# Altium schematic sheet Sheet1.SchDoc
size A4
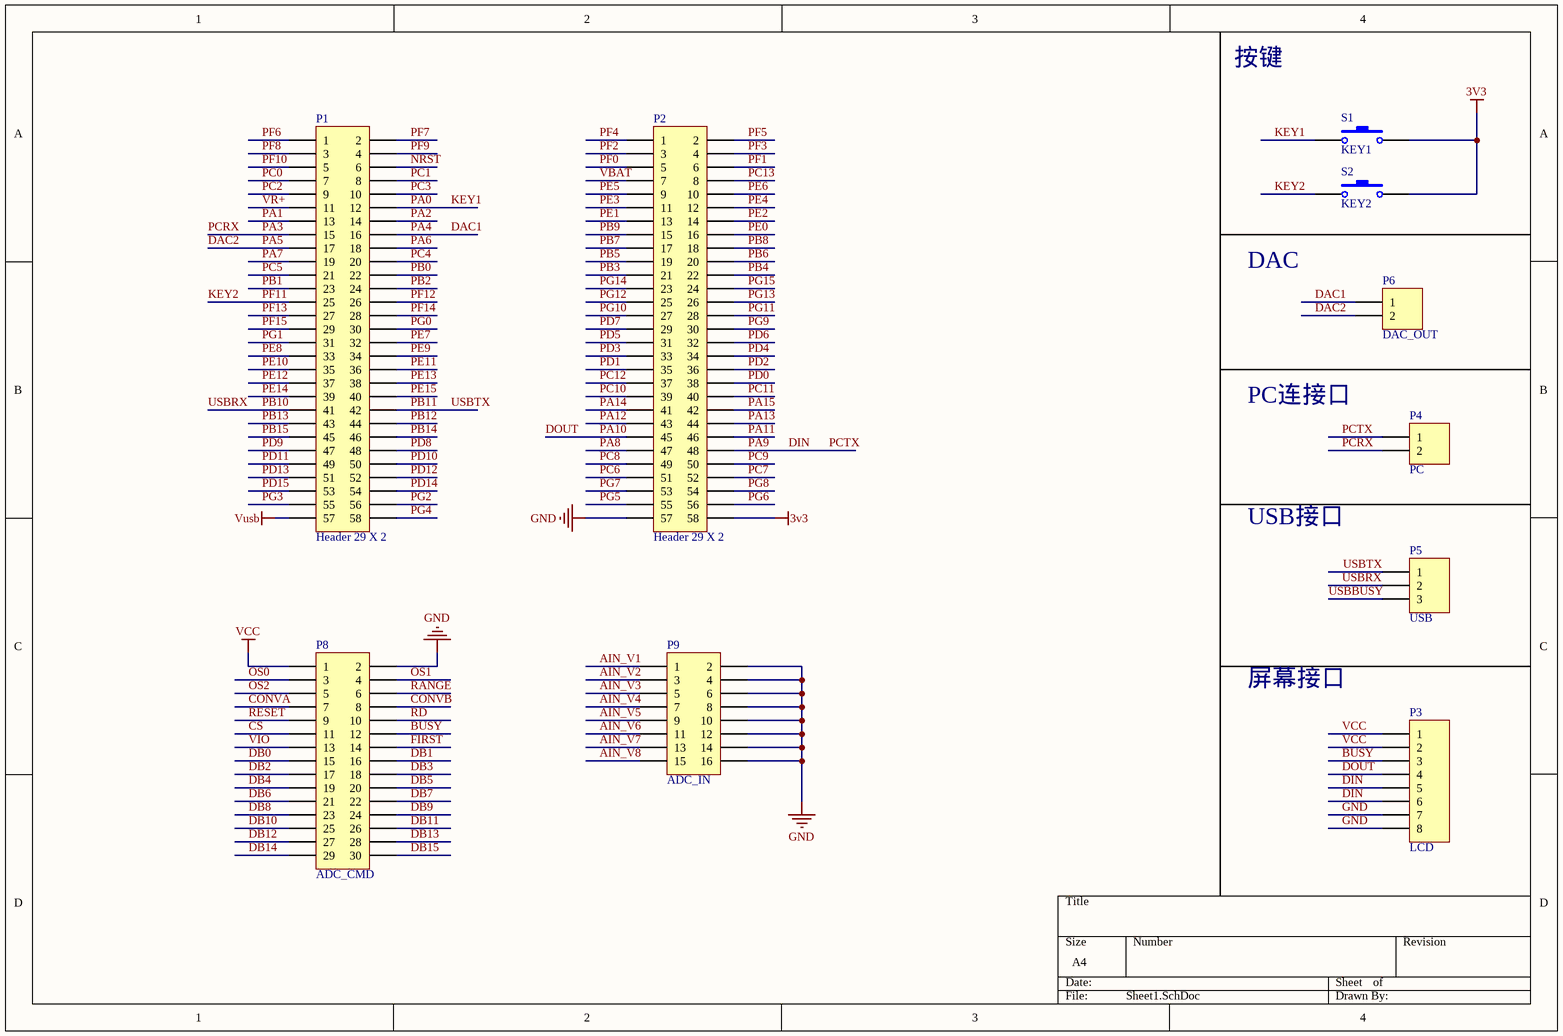
[diagram p0: Sheet1.SchDoc]

## Parts
P1  Header 29 X 2  [HDR2X29]
P2  Header 29 X 2  [HDR2X29]
P3  LCD  [HDR1X8]
P4  PC  [HDR1X2]
P5  USB  [HDR1X3]
P6  DAC_OUT  [HDR1X2]
P8  ADC_CMD  [HDR2X15]
P9  ADC_IN  [HDR2X8]
S1  KEY1  [SPST-2]
S2  KEY2  [SPST-2]

## Nets
3v3: P2.58 S1.2 S2.2
GND: P2.57 P3.7 P3.8 P8.2 P9.2 P9.4 P9.6 P9.8 P9.10 P9.12 P9.14 P9.16
VCC: P3.1 P3.2 P8.1
Vusb: P1.57
AIN_V1: P9.1
AIN_V2: P9.3
AIN_V3: P9.5
AIN_V4: P9.7
AIN_V5: P9.9
AIN_V6: P9.11
AIN_V7: P9.13
AIN_V8: P9.15
BUSY: P3.3 P8.12
CONVA: P8.7
CONVB: P8.8
CS: P8.11
DAC1: P1.16 P6.1  [also labelled PA4]
DAC2: P1.17 P6.2  [also labelled PA5]
DB0: P8.15
DB1: P8.16
DB2: P8.17
DB3: P8.18
DB4: P8.19
DB5: P8.20
DB6: P8.21
DB7: P8.22
DB8: P8.23
DB9: P8.24
DB10: P8.25
DB11: P8.26
DB12: P8.27
DB13: P8.28
DB14: P8.29
DB15: P8.30
DIN: P2.48 P3.5 P3.6 P4.1  [also labelled PA9, PCTX]
DOUT: P2.45 P3.4  [also labelled PA10]
FIRST: P8.14
KEY1: P1.12 S1.1  [also labelled PA0]
KEY2: P1.25 S2.1  [also labelled PF11]
NRST: P1.6
OS0: P8.3
OS1: P8.4
OS2: P8.5
PA1: P1.13
PA2: P1.14
PA3: P1.15 P4.2  [also labelled PCRX]
PA6: P1.18
PA7: P1.19
PA8: P2.47
PA11: P2.46
PA12: P2.43
PA13: P2.44
PA14: P2.41
PA15: P2.42
PB0: P1.22
PB1: P1.23
PB2: P1.24
PB3: P2.21
PB4: P2.22
PB5: P2.19
PB6: P2.20
PB7: P2.17
PB8: P2.18
PB9: P2.15
PB10: P1.41 P5.2  [also labelled USBRX]
PB11: P1.42 P5.1  [also labelled USBTX]
PB12: P1.44
PB13: P1.43
PB14: P1.46
PB15: P1.45
PC0: P1.7
PC1: P1.8
PC2: P1.9
PC3: P1.10
PC4: P1.20
PC5: P1.21
PC6: P2.51
PC7: P2.52
PC8: P2.49
PC9: P2.50
PC10: P2.39
PC11: P2.40
PC12: P2.37
PC13: P2.8
PD0: P2.38
PD1: P2.35
PD2: P2.36
PD3: P2.33
PD4: P2.34
PD5: P2.31
PD6: P2.32
PD7: P2.29
PD8: P1.48
PD9: P1.47
PD10: P1.50
PD11: P1.49
PD12: P1.52
PD13: P1.51
PD14: P1.54
PD15: P1.53
PE0: P2.16
PE1: P2.13
PE2: P2.14
PE3: P2.11
PE4: P2.12
PE5: P2.9
PE6: P2.10
PE7: P1.32
PE8: P1.33
PE9: P1.34
PE10: P1.35
PE11: P1.36
PE12: P1.37
PE13: P1.38
PE14: P1.39
PE15: P1.40
PF0: P2.5
PF1: P2.6
PF2: P2.3
PF3: P2.4
PF4: P2.1
PF5: P2.2
PF6: P1.1
PF7: P1.2
PF8: P1.3
PF9: P1.4
PF10: P1.5
PF12: P1.26
PF13: P1.27
PF14: P1.28
PF15: P1.29
PG0: P1.30
PG1: P1.31
PG2: P1.56
PG3: P1.55
PG4: P1.58
PG5: P2.55
PG6: P2.56
PG7: P2.53
PG8: P2.54
PG9: P2.30
PG10: P2.27
PG11: P2.28
PG12: P2.25
PG13: P2.26
PG14: P2.23
PG15: P2.24
RANGE: P8.6
RD: P8.10
RESET: P8.9
USBBUSY: P5.3
VBAT: P2.7
VIO: P8.13
VR+: P1.11

## Notes on the sheet
- 按键
- DAC
- PC连接口
- USB接口
- 屏幕接口

## Library data of the parts
P1 P2 = Header 29 X 2: Header, 29-Pin, Dual row
P3 = Header 8: Header, 8-Pin; LatestRevisionDate: 17-Jul-2002; LatestRevisionNote: Re-released for DXP Platform.; Publisher: Altium Limited
P4 P6 = Header 2: Header, 2-Pin; LatestRevisionDate: 17-Jul-2002; LatestRevisionNote: Re-released for DXP Platform.; Publisher: Altium Limited
P5 = Header 3: Header, 3-Pin; LatestRevisionDate: 17-Jul-2002; LatestRevisionNote: Re-released for DXP Platform.; Publisher: Altium Limited
P8 = Header 15X2: Header, 15-Pin, Dual row; LatestRevisionDate: 17-Jul-2002; LatestRevisionNote: Re-released for DXP Platform.; Publisher: Altium Limited
P9 = Header 8X2: Header, 8-Pin, Dual row; LatestRevisionDate: 17-Jul-2002; LatestRevisionNote: Re-released for DXP Platform.; Publisher: Altium Limited
S1 S2 = SW-PB: Switch; Published: 24-Mar-1999; LatestRevisionDate: 17-Jul-2002; LatestRevisionNote: Re-released for DXP Platform.; PackageReference: SPST-2; Publisher: Altium Limited; PackageDescription: Switch; 2 Leads